# Altium schematic sheet NC.SchDoc
size A2; SheetNumber: 1; SheetTotal: 1; SPICEModelCacheSRYGUZUU: <root> / <DocumentId>SRYGUZUU</DocumentId> / </root>
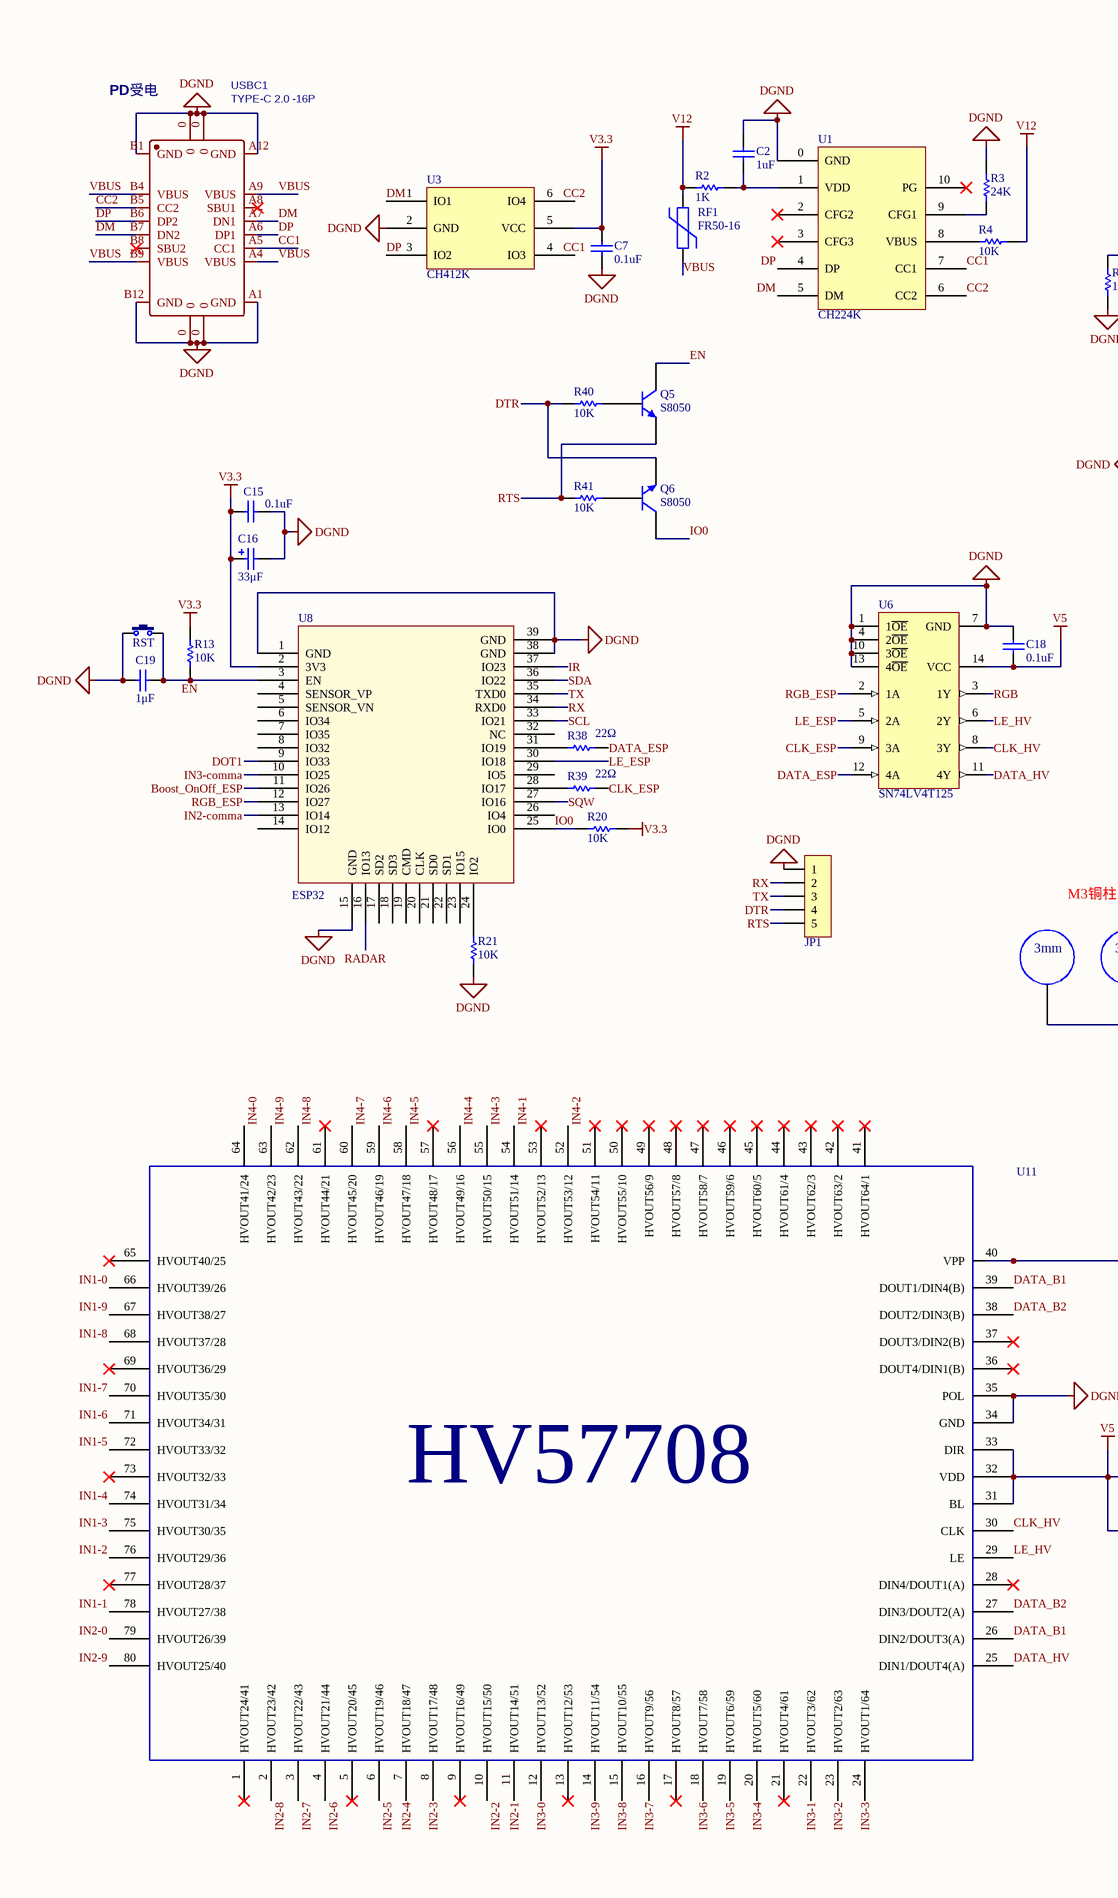
[diagram p0: NC.SchDoc, left]
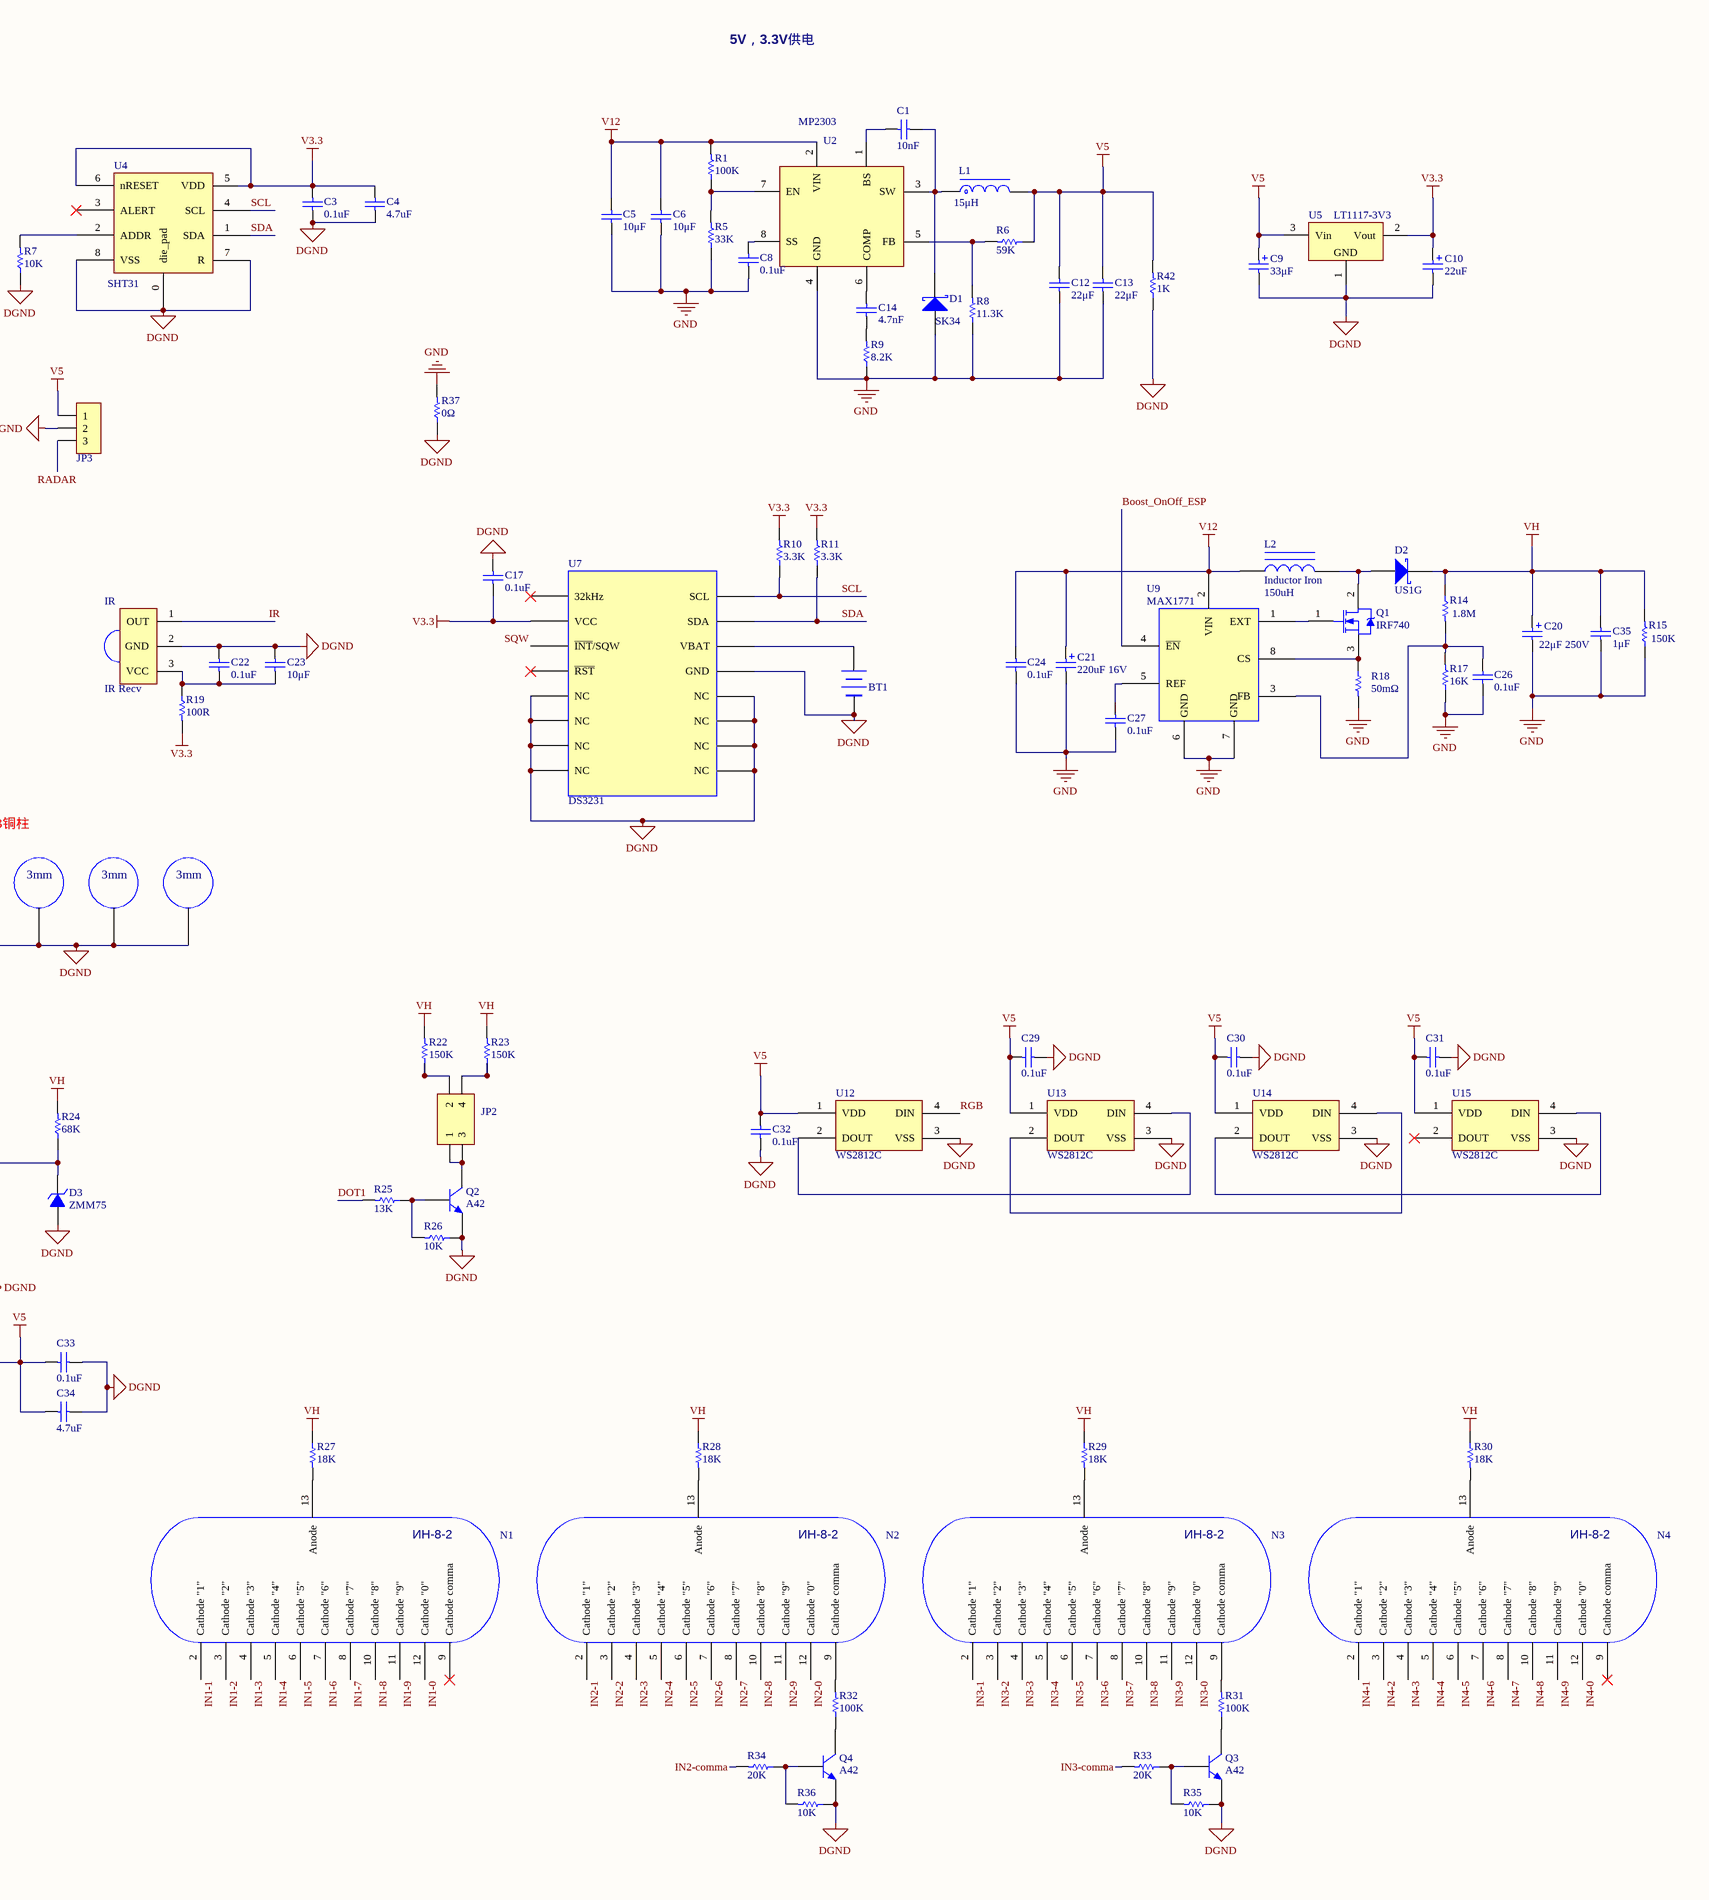
[diagram p1: NC.SchDoc, right]

## Parts
BT1  CR1220 holder  [BAT1220]  (value not drawn)
C1  value 10nF  [C 0805_L]  (hidden comment: Cap)
C2  value 1uF  [C 0805_L]  (hidden comment: Cap)
C3  value 0.1uF  [C 0805_L]  (hidden comment: Cap)
C4  value 4.7uF  [C 0805_L]  (hidden comment: Cap)
C5  value 10μF  [C 0805_L]  (hidden comment: Cap)
C6  value 10μF  [C 0805_L]  (hidden comment: Cap)
C7  value 0.1uF  [C 0805_L]  (hidden comment: Cap)
C8  value 0.1uF  [C 0805_L]  (hidden comment: Cap)
C9  value 33μF  [CM C(5*5.4)]  (hidden comment: Cap Pol1)
C10  value 22uF  [CD C(6032)]  (hidden comment: Cap Pol1)
C12  value 22μF  [C 1206_L]  (hidden comment: Cap)
C13  value 22μF  [C 1206_L]  (hidden comment: Cap)
C14  value 4.7nF  [C 0805_L]  (hidden comment: Cap)
C15  value 0.1uF  [C 0805_L]  (hidden comment: Cap)
C16  value 33μF  [CD B(3528)]  (hidden comment: Cap Pol1)
C17  value 0.1uF  [C 0805_L]  (hidden comment: Cap)
C18  value 0.1uF  [C 0805_L]  (hidden comment: Cap)
C19  value 1μF  [C 0805_L]  (hidden comment: Cap)
C20  value 22μF 250V  [CAP 5.0*10*16-H - GD]  (hidden comment: Cap Pol1)
C21  value 220uF 16V  [CM D(6.3*7.7)]  (hidden comment: Cap Pol1)
C22  value 0.1uF  [C 0805_L]  (hidden comment: Cap)
C23  value 10μF  [C 0805_L]  (hidden comment: Cap)
C24  value 0.1uF  [C 0805_L]  (hidden comment: Cap)
C26  value 0.1uF  [C 0805_L]  (hidden comment: Cap)
C27  value 0.1uF  [C 0805_L]  (hidden comment: Cap)
C29  value 0.1uF  [C 0805_L]  (hidden comment: Cap)
C30  value 0.1uF  [C 0805_L]  (hidden comment: Cap)
C31  value 0.1uF  [C 0805_L]  (hidden comment: Cap)
C32  value 0.1uF  [C 0805_L]  (hidden comment: Cap)
C33  value 0.1uF  [C 0805_L]  (hidden comment: Cap)
C34  value 4.7uF  [C 0805_L]  (hidden comment: Cap)
C35  value 1μF  [C 1210_L]  (hidden comment: Cap)
D1  SK34  [SMA]
D2  US1G  [SMA]
D3  ZMM75  [LL-34]
IR  IR Recv  [HDR2.54-LI-3P - duplicate]
JP1  HDR-1X5  [HDR2.0-LI-5P]  (value not drawn)
JP2  Header2X2  [HDR2.54-LI-2x2P]  (value not drawn)
JP3  HDR-1X3  [ZH1.5-WS-3P]  (value not drawn)
L1  value 15μH  [CKST0603]  (hidden comment: 10uH)
L2  Inductor Iron  value 150uH  [CD104]
N1  ИН-8-2  [IN8-2]  (value not drawn)
N2  ИН-8-2  [IN8-2]  (value not drawn)
N3  ИН-8-2  [IN8-2]  (value not drawn)
N4  ИН-8-2  [IN8-2]  (value not drawn)
Q1  IRF740  [TO-263-2L]
Q2  A42  [SOT-23-3L]
Q3  A42  [SOT-23-3L]
Q4  A42  [SOT-23-3L]
Q5  S8050  [SOT-23-3L]
Q6  S8050  [SOT-23-3L]
R1  value 100K  [R 0805_L]  (hidden comment: Resistor)
R2  value 1K  [R 0805_L]  (hidden comment: Resistor)
R3  value 24K  [R 0805_L]  (hidden comment: Resistor)
R4  value 10K  [R 0805_L]  (hidden comment: Resistor)
R5  value 33K  [R 0805_L]  (hidden comment: Resistor)
R6  value 59K  [R 0805_L]  (hidden comment: Resistor)
R7  value 10K  [R 0805_L]  (hidden comment: Resistor)
R8  value 11.3K  [R 0805_L]  (hidden comment: Resistor)
R9  value 8.2K  [R 0805_L]  (hidden comment: Resistor)
R10  value 3.3K  [R 0805_L]  (hidden comment: Resistor)
R11  value 3.3K  [R 0805_L]  (hidden comment: Resistor)
R13  value 10K  [R 0805_L]  (hidden comment: Resistor)
R14  value 1.8M  [R 0805_L]  (hidden comment: Res Semi)
R15  value 150K  [R 1206_L]  (hidden comment: Resistor)
R17  value 16K  [R 0805_L]  (hidden comment: Resistor)
R18  value 50mΩ  [R 1206_L]  (hidden comment: Res Semi)
R19  value 100R  [R 0805_L]  (hidden comment: Resistor)
R20  value 10K  [R 0805_L]  (hidden comment: Resistor)
R21  value 10K  [R 0805_L]  (hidden comment: Resistor)
R22  value 150K  [R 0805_L]  (hidden comment: Resistor)
R23  value 150K  [R 0805_L]  (hidden comment: Resistor)
R24  value 68K  [R 1206_L]  (hidden comment: Resistor)
R25  value 13K  [R 0805_L]  (hidden comment: Resistor)
R26  value 10K  [R 0805_L]  (hidden comment: Resistor)
R27  value 18K  [R 0805_L]  (hidden comment: Resistor)
R28  value 18K  [R 0805_L]  (hidden comment: Resistor)
R29  value 18K  [R 0805_L]  (hidden comment: Resistor)
R30  value 18K  [R 0805_L]  (hidden comment: Resistor)
R31  value 100K  [R 0805_L]  (hidden comment: Resistor)
R32  value 100K  [R 0805_L]  (hidden comment: Resistor)
R33  value 20K  [R 0805_L]  (hidden comment: Resistor)
R34  value 20K  [R 0805_L]  (hidden comment: Resistor)
R35  value 10K  [R 0805_L]  (hidden comment: Resistor)
R36  value 10K  [R 0805_L]  (hidden comment: Resistor)
R37  value 0Ω  [R 0805_L]  (hidden comment: Resistor)
R38  value 22Ω  [R 0805_L]  (hidden comment: Resistor)
R39  value 22Ω  [R 0805_L]  (hidden comment: Resistor)
R40  value 10K  [R 0805_L]  (hidden comment: Resistor)
R41  value 10K  [R 0805_L]  (hidden comment: Resistor)
R42  value 1K  [R 0805_L]  (hidden comment: Resistor)
RF1  FR50-16  [FU 1206]
RST  3x6x5  [TSW SMD-3*6*2.5]  (value not drawn)
T1  铜柱  [螺丝孔-3mm]  (value not drawn)
T2  铜柱  [螺丝孔-3mm]  (value not drawn)
T3  铜柱  [螺丝孔-3mm]  (value not drawn)
T4  铜柱  [螺丝孔-3mm]  (value not drawn)
U1  CH224K  [ESSOP10]
U2  MP2303  [SOIC8E]
U3  CH412K  [SOT-363]
U4  SHT31  [DFN-8]
U5  LT1117-3V3  [SOT223_L]
U6  SN74LV4T125  [TSSOP14_L]
U7  DS3231  [SOP16_75MM]
U8  ESP32  [ESP32]
U9  MAX1771  [SOIC8]
U11  HV57708  [HV57708PG]  (value not drawn)
U12  WS2812C  [WS2812]
U13  WS2812C  [WS2812]
U14  WS2812C  [WS2812]
U15  WS2812C  [WS2812]
USBC1  TYPE-C 2.0 -16P  [USB-C-SMD_TYPE-C-USB-5]

## Nets
DGND: BT1.2(-) C2.2 C3.1 C4.1 C7.1 C9.2 C10.2 C15.2 C16.2 C17.2 C18.2 C19.1 C22.2 C23.2 C29.1 C30.1 C31.1 C32.1 C33.2 C34.1 D3.1(A) IR.2(GND) JP1.1 JP3.2 Q2.2(E) Q3.2(E) Q4.2(E) R3.1 R7.1 R21.1 R26.1 R35.1 R36.1 R37.1 R42.1 RST.1 T1.1 T2.1 T3.1 T4.1 U1.0(GND) U3.2(GND) U4.0(die_pad) U4.7(R) U4.8(VSS) U5.1(GND) U6.1(1~{OE}) U6.4(2~{OE}) U6.7(GND) U6.10(3~{OE}) U6.13(4~{OE}) U7.5(NC) U7.6(NC) U7.7(NC) U7.8(NC) U7.9(NC) U7.10(NC) U7.11(NC) U7.12(NC) U7.13(GND) U8.1(GND) U8.15(GND) U8.38(GND) U8.39(GND) U11.34(GND) U11.35(POL) U12.3(VSS) U13.3(VSS) U14.3(VSS) U15.3(VSS) USBC1.0 USBC1.A1(GND) USBC1.A12(GND) USBC1.B1(GND) USBC1.B12(GND)
GND: C5.1 C6.1 C8.1 C12.1 C13.1 C20.2 C21.2 C24.1 C26.1 C27.2 C35.1 D1.1(A) R5.1 R8.1 R9.1 R15.1 R17.1 R18.2 R37.2 U2.4(GND) U9.6(GND) U9.7(GND)
V3.3: C3.2 C4.2 C7.2 C10.1 C15.1 C16.1 C17.1 R10.2 R11.2 R13.2 R19.2 R20.1 U3.5(VCC) U4.5(VDD) U4.6(nRESET) U5.2(Vout) U7.2(VCC) U8.2(3V3)
V5: C9.1 C12.2 C13.2 C18.1 C29.2 C30.2 C31.2 C32.2 C33.1 C34.2 JP3.1 L1.2 R6.1 R42.2 U5.3(Vin) U6.14(VCC) U11.31(BL) U11.32(VDD) U11.33(DIR) U12.1(VDD) U13.1(VDD) U14.1(VDD) U15.1(VDD)
V12: C5.2 C6.2 C21.1 C24.2 L2.1 R1.2 R2.2 R4.1 RF1.2 U2.2(VIN) U9.2(VIN)
VH: C20.1 C35.2 D2.2(K) R14.1 R15.2 R22.2 R23.2 R24.2 R27.1 R28.1 R29.1 R30.1
Boost_OnOff_ESP: U8.11(IO26) U9.4(~{EN})
CC1: U1.7(CC1) U3.4(IO3) USBC1.A5(CC1)
CC2: U1.6(CC2) U3.6(IO4) USBC1.B5(CC2)
CLK_ESP: R39.1 U6.9(3A)
CLK_HV: U6.8(3Y) U11.30(CLK)
DATA_B1: U11.26(DIN2/DOUT3(A)) U11.39(DOUT1/DIN4(B))
DATA_B2: U11.27(DIN3/DOUT2(A)) U11.38(DOUT2/DIN3(B))
DATA_ESP: R38.1 U6.12(4A)
DATA_HV: U6.11(4Y) U11.25(DIN1/DOUT4(A))
DM: U1.5(DM) U3.1(IO1) USBC1.A7(DN1) USBC1.B7(DN2)
DOT1: R25.2 U8.9(IO33)
DP: U1.4(DP) U3.3(IO2) USBC1.A6(DP1) USBC1.B6(DP2)
DTR: JP1.4 Q6.2(E) R40.2
EN: C19.2 Q5.3(C) R13.1 RST.2 U8.3(EN)
IN1-0: N1.12(Cathode_"0") U11.66(HVOUT39/26)
IN1-1: N1.2(Cathode_"1") U11.78(HVOUT27/38)
IN1-2: N1.3(Cathode_"2") U11.76(HVOUT29/36)
IN1-3: N1.4(Cathode_"3") U11.75(HVOUT30/35)
IN1-4: N1.5(Cathode_"4") U11.74(HVOUT31/34)
IN1-5: N1.6(Cathode_"5") U11.72(HVOUT33/32)
IN1-6: N1.7(Cathode_"6") U11.71(HVOUT34/31)
IN1-7: N1.8(Cathode_"7") U11.70(HVOUT35/30)
IN1-8: N1.10(Cathode_"8") U11.68(HVOUT37/28)
IN1-9: N1.11(Cathode_"9") U11.67(HVOUT38/27)
IN2-0: N2.12(Cathode_"0") U11.79(HVOUT26/39)
IN2-1: N2.2(Cathode_"1") U11.11(HVOUT14/51)
IN2-2: N2.3(Cathode_"2") U11.10(HVOUT15/50)
IN2-3: N2.4(Cathode_"3") U11.8(HVOUT17/48)
IN2-4: N2.5(Cathode_"4") U11.7(HVOUT18/47)
IN2-5: N2.6(Cathode_"5") U11.6(HVOUT19/46)
IN2-6: N2.7(Cathode_"6") U11.4(HVOUT21/44)
IN2-7: N2.8(Cathode_"7") U11.3(HVOUT22/43)
IN2-8: N2.10(Cathode_"8") U11.2(HVOUT23/42)
IN2-9: N2.11(Cathode_"9") U11.80(HVOUT25/40)
IN2-comma: R34.2 U8.13(IO14)
IN3-0: N3.12(Cathode_"0") U11.12(HVOUT13/52)
IN3-1: N3.2(Cathode_"1") U11.22(HVOUT3/62)
IN3-2: N3.3(Cathode_"2") U11.23(HVOUT2/63)
IN3-3: N3.4(Cathode_"3") U11.24(HVOUT1/64)
IN3-4: N3.5(Cathode_"4") U11.20(HVOUT5/60)
IN3-5: N3.6(Cathode_"5") U11.19(HVOUT6/59)
IN3-6: N3.7(Cathode_"6") U11.18(HVOUT7/58)
IN3-7: N3.8(Cathode_"7") U11.16(HVOUT9/56)
IN3-8: N3.10(Cathode_"8") U11.15(HVOUT10/55)
IN3-9: N3.11(Cathode_"9") U11.14(HVOUT11/54)
IN3-comma: R33.2 U8.10(IO25)
IN4-0: N4.12(Cathode_"0") U11.64(HVOUT41/24)
IN4-1: N4.2(Cathode_"1") U11.54(HVOUT51/14)
IN4-2: N4.3(Cathode_"2") U11.52(HVOUT53/12)
IN4-3: N4.4(Cathode_"3") U11.55(HVOUT50/15)
IN4-4: N4.5(Cathode_"4") U11.56(HVOUT49/16)
IN4-5: N4.6(Cathode_"5") U11.58(HVOUT47/18)
IN4-6: N4.7(Cathode_"6") U11.59(HVOUT46/19)
IN4-7: N4.8(Cathode_"7") U11.60(HVOUT45/20)
IN4-8: N4.10(Cathode_"8") U11.62(HVOUT43/22)
IN4-9: N4.11(Cathode_"9") U11.63(HVOUT42/23)
IO0: Q6.3(C) R20.2 U8.25(IO0)
IR: IR.1(OUT) U8.37(IO23)
LE_ESP: U6.5(2A) U8.30(IO18)
LE_HV: U6.6(2Y) U11.29(LE)
RADAR: JP3.3 U8.16(IO13)
RGB: U6.3(1Y) U12.4(DIN)
RGB_ESP: U6.2(1A) U8.12(IO27)
RTS: JP1.5 Q5.2(E) R41.2
RX: JP1.2 U8.34(RXD0)
SCL: R10.1 U4.4(SCL) U7.16(SCL) U8.33(IO21)
SDA: R11.1 U4.1(SDA) U7.15(SDA) U8.36(IO22)
SQW: U7.3(~{INT}/SQW) U8.27(IO16)
TX: JP1.3 U8.35(TXD0)
VBUS: RF1.1 USBC1.A4(VBUS) USBC1.A9(VBUS) USBC1.B4(VBUS) USBC1.B9(VBUS)
NetBT1_1: BT1.1(+) U7.14(VBAT)
NetC1_1: C1.1 D1.2(K) L1.1 U2.3(SW)
NetC1_2: C1.2 U2.1(BS)
NetC2_1: C2.1 R2.1 U1.1(VDD)
NetC8_2: C8.2 U2.8(SS)
NetC14_1: C14.1 R9.2
NetC14_2: C14.2 U2.6(COMP)
NetC22_1: C22.1 C23.1 IR.3(VCC) R19.1
NetC26_2: C26.2 R14.2 R17.2 U9.3(FB)
NetC27_1: C27.1 U9.5(REF)
NetD2_1: D2.1(A) L2.2 Q1.2(D)
NetD3_2: D3.2(K) R24.1 U11.40(VPP)
NetJP2_1: JP2.1 JP2.3 Q2.3(C)
NetJP2_2: JP2.2 R22.1
NetJP2_4: JP2.4 R23.1
NetN1_13: N1.13(Anode) R27.2
NetN2_9: N2.9(Cathode_comma) R32.2
NetN2_13: N2.13(Anode) R28.2
NetN3_9: N3.9(Cathode_comma) R31.2
NetN3_13: N3.13(Anode) R29.2
NetN4_13: N4.13(Anode) R30.2
NetQ1_1: Q1.1(G) U9.1(EXT)
NetQ1_3: Q1.3(S) R18.1 U9.8(CS)
NetQ2_1: Q2.1(B) R25.1 R26.2
NetQ3_1: Q3.1(B) R33.1 R35.2
NetQ3_3: Q3.3(C) R31.1
NetQ4_1: Q4.1(B) R34.1 R36.2
NetQ4_3: Q4.3(C) R32.1
NetQ5_1: Q5.1(B) R40.1
NetQ6_1: Q6.1(B) R41.1
NetR1_1: R1.1 R5.2 U2.7(EN)
NetR3_2: R3.2 U1.9(CFG1)
NetR4_2: R4.2 U1.8(VBUS)
NetR6_2: R6.2 R8.2 U2.5(FB)
NetR7_2: R7.2 U4.2(ADDR)
NetR21_2: R21.2 U8.24(IO2)
NetR38_2: R38.2 U8.31(IO19)
NetR39_2: R39.2 U8.28(IO17)
NetU12_2: U12.2(DOUT) U13.4(DIN)
NetU13_2: U13.2(DOUT) U14.4(DIN)
NetU14_2: U14.2(DOUT) U15.4(DIN)

Not connected (* = marked no-connect by the designer): N1 9(Cathode_comma)*; N4 9(Cathode_comma)*; U1 2(CFG2)* 3(CFG3)* 10(PG)*; U2 9(GND); U4 3(ALERT)*; U7 1(32kHz)* 4(~{RST})*; U8 4(SENSOR_VP) 5(SENSOR_VN) 6(IO34) 7(IO35) 8(IO32) 14(IO12) 17(SD2) 18(SD3) 19(CMD) 20(CLK) 21(SD0) 22(SD1) 23(IO15) 26(IO4) 29(IO5) 32(NC); U11 1(HVOUT24/41)* 5(HVOUT20/45)* 9(HVOUT16/49)* 13(HVOUT12/53)* 17(HVOUT8/57)* 21(HVOUT4/61)* 28(DIN4/DOUT1(A))* 36(DOUT4/DIN1(B))* 37(DOUT3/DIN2(B))* 41(HVOUT64/1)* 42(HVOUT63/2)* 43(HVOUT62/3)* 44(HVOUT61/4)* 45(HVOUT60/5)* 46(HVOUT59/6)* 47(HVOUT58/7)* 48(HVOUT57/8)* 49(HVOUT56/9)* 50(HVOUT55/10)* 51(HVOUT54/11)* 53(HVOUT52/13)* 57(HVOUT48/17)* 61(HVOUT44/21)* 65(HVOUT40/25)* 69(HVOUT36/29)* 73(HVOUT32/33)* 77(HVOUT28/37)*; U15 2(DOUT)*; USBC1 A8(SBU1)* B8(SBU2)*

## Notes on the sheet
- (near USBC1) PD受电
- 5V，3.3V供电
- M3铜柱
- (in symbol 铜柱) 3mm

## Library data of the parts
BT1 = BATTERY
C1-C8 C12-C15 C17-C19 C22-C24 C26 C27 C29-C35 = Cap: Capacitor; Published: 8-Jun-2000; LatestRevisionDate: 17-Jul-2002; LatestRevisionNote: Re-released for DXP Platform.; PackageReference: RAD-0.3; Publisher: Altium Limited; PackageDescription: Radial Cap, Thru-Hole; 2 Leads; 0.3 in Pin Spacing
C9 C10 C16 = Cap Pol1: Polarized Capacitor (Radial); Published: 8-Jun-2000; LatestRevisionDate: 17-Jul-2002; LatestRevisionNote: Re-released for DXP Platform.; PackageReference: RB7.6-15; Publisher: Altium Limited
C20 = Cap Pol1_3: Polarized Capacitor (Radial); Published: 8-Jun-2000; LatestRevisionDate: 17-Jul-2002; LatestRevisionNote: Re-released for DXP Platform.; PackageReference: RB7.6-15; Publisher: Altium Limited; PackageDescription: Polarized Capacitor (Radial); 2 Leads
C21 = Cap Pol1_2: Polarized Capacitor (Radial); Voltage: 16V; Published: 8-Jun-2000; LatestRevisionDate: 17-Jul-2002; LatestRevisionNote: Re-released for DXP Platform.; PackageReference: RB7.6-15; Publisher: Altium Limited; PackageDescription: Polarized Capacitor (Radial); 2 Leads
D1 D2 = D Schottky: Schottky Diode; Published: 8-Jun-2000; LatestRevisionDate: 17-Jul-2002; LatestRevisionNote: Re-released for DXP Platform.; PackageReference: SMB; Publisher: Altium Limited; PackageDescription: DO-214-AA/SMB; 2 C-Bend Leads; Body 5.3 x 3.6 mm, inc. leads (LxW); Code_JEDEC: DO-214-AA
D3 = 1N5256: 75V/0.5W稳压管; BOM名称: 30V/0.5W稳压管; 版权归属: 封装库来自淘宝 ID：黄晶宝石; 学习资源: www.ooocke.com
IR = VS1838B: 红外接收头
JP1 = Header 5: 5P接插件; 版权归属: 封装库来自淘宝 ID：黄晶宝石; BOM名称: 5P接插件; 学习资源: https://shop463601444.taobao.com
JP2 = Header 2X2: 2*2P接插件; 版权归属: 封装库来自淘宝 ID：黄晶宝石; BOM名称: 2*2P接插件; 学习资源: https://shop463601444.taobao.com
JP3 = Header 3: 3P接插件; 版权归属: 封装库来自淘宝 ID：黄晶宝石; BOM名称: 3P接插件; 学习资源: https://shop463601444.taobao.com
L1 = L-SMD: CD系列贴片线绕功率电感; BOM名称: 功率电感; 淘宝ID: 封装库来自淘宝 ID：黄晶宝石; 学习资源: www.ooocke.com
L2 = Inductor Iron: Magnetic-Core Inductor; Published: 24-Mar-1999; LatestRevisionDate: 17-Jul-2002; LatestRevisionNote: Re-released for DXP Platform.; PackageReference: AXIAL-0.9; Publisher: Altium Limited; PackageDescription: Axial Device, Thru-Hole; 2 Leads; 0.9 in Pin Spacing
Q1 = NMOS-2: N-Channel Power MOSFET; Note: Pin 2 is electrically connected to pin 4.; Published: 8-Jun-2000; LatestRevisionDate: 17-Jul-2002; LatestRevisionNote: Re-released for DXP Platform.; DatasheetVersion: PD-9.814; PackageVersion: Feb-1997; PackageReference: TO-220AB; Publisher: Altium Limited; PackageDescription: TO, Thru-Hole, Vertical, Heatsink Mounted; 3 In-Line Leads; Pitch 2.54 mm; ComponentLink1Description: Manufacturer Link; ComponentLink1URL: http://www.irf.com/
Q2-Q6 = NPN: NPN Bipolar Transistor; Published: 8-Jun-2000; LatestRevisionDate: 17-Jul-2002; LatestRevisionNote: Re-released for DXP Platform.; PackageReference: TO-226; Publisher: Altium Limited; Code_JEDEC: TO-226-AA
R14 R18 = Res Semi: Semiconductor Resistor; Published: 8-Jun-2000; LatestRevisionDate: 17-Jul-2002; LatestRevisionNote: Re-released for DXP Platform.; PackageReference: AXIAL-0.5; Publisher: Altium Limited
RF1 = PPTC: PPTC自恢复保险丝; Current: 500mA; BOM名称: PPTC自恢复保险丝
RST = TSW 3x6: 3x6轻触开关; 版权归属: 封装库来自淘宝 ID：黄晶宝石; BOM名称: 3x6轻触开关; 学习资源: https://shop463601444.taobao.com
U1 = CH224K: PD协议受电芯片
U2 = MP2303: DC-DC降压芯片。4.75V-28V，3A
U3 = CH412K: 四路ESD保护
U4 = SHT3x: Humidity and Temperature Sensor
U5 = AMS1117: 三端稳压芯片; BOM名称: 稳压芯片; 版权归属: 源创客; 学习资源: www.ooocke.com
U6 = SN74LV4T125: 单电源4路逻辑电平转换
U12-U15 = WS2812: RGB发光管
USBC1 = USB2.0 Type-C 16Pin母座: USB2.0 Type-C 母座 16Pin; BOM_Manufacturer: LCSC; BOM_Supplier: LCSC; BOM_Manufacturer Part: -; spicePre: U; spiceSymbolName: TYPE-C 3.1 -16P_C168689
R1-R11 R13 R15 R17 R19-R42 = Resistor: Published: 8-Jun-2000; LatestRevisionDate: 17-Jul-2002; LatestRevisionNote: Re-released for DXP Platform.; PackageReference: AXIAL-0.5; Publisher: Altium Limited